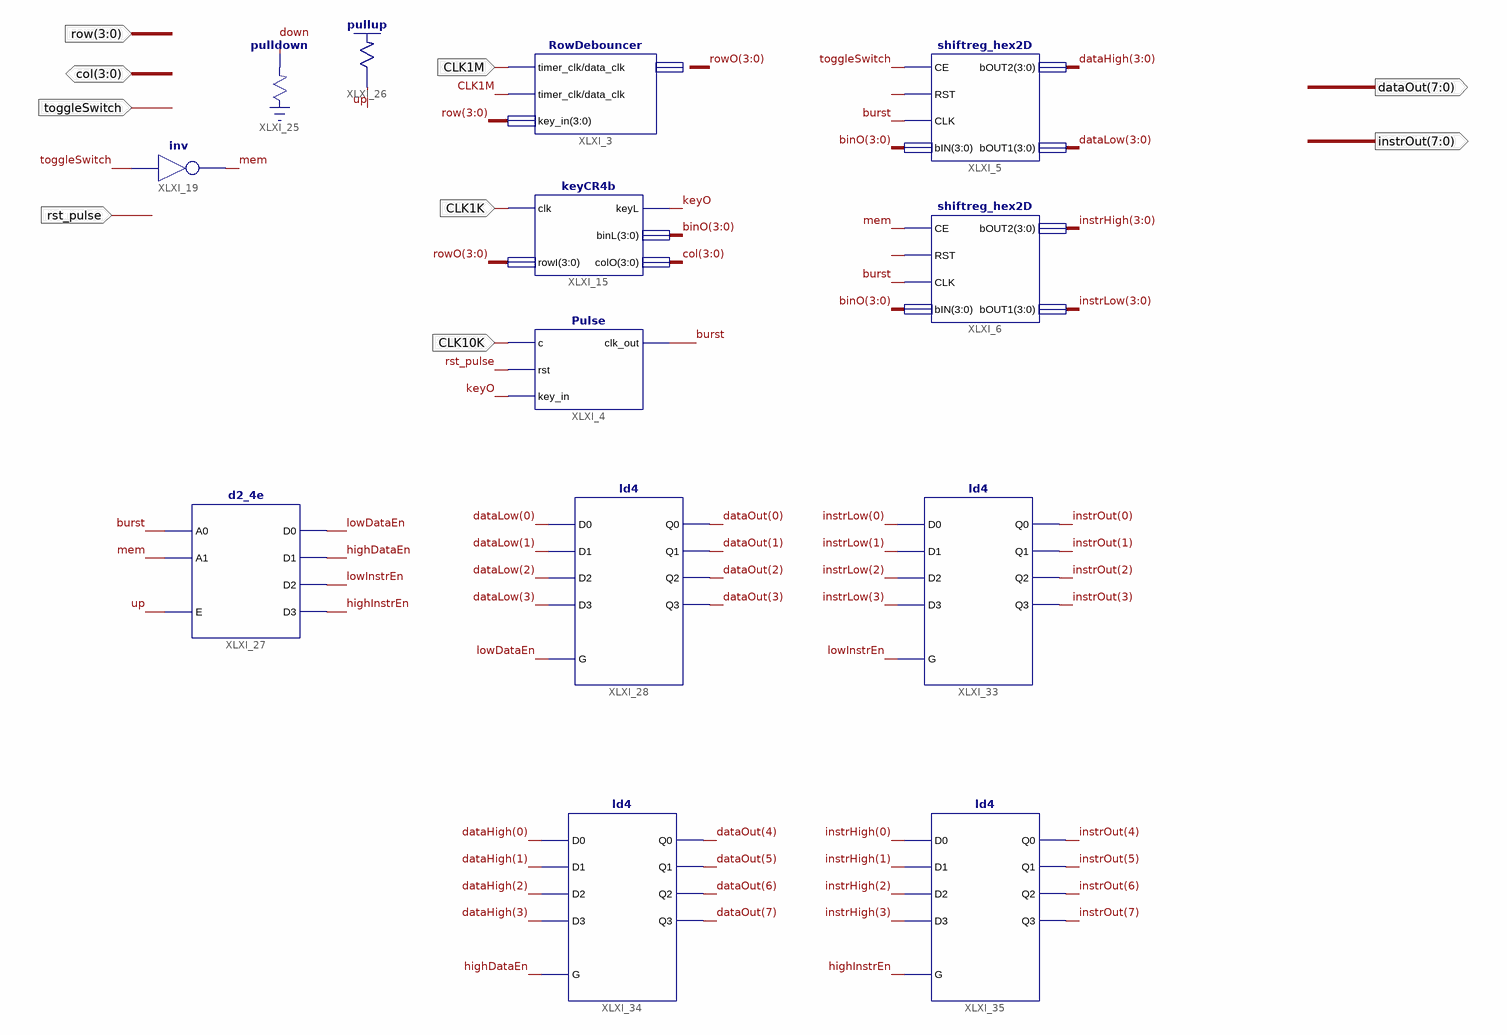
[diagram p0: schematic sheet 1]
// Xilinx ISE schematic Keypad.sch (spartan3e) as structural Verilog: 13 symbols, 9 ports
module Keypad (
  input  [3:0] row,
  input  CLK10K,
  input  toggleSwitch,
  input  rst_pulse,
  input  CLK1M,
  input  CLK1K,
  inout  [3:0] col,
  output [7:0] dataOut,
  output [7:0] instrOut
);

  wire burst, down, highDataEn, highInstrEn, keyO, lowDataEn, lowInstrEn, mem, up, XLXN_29, XLXN_33;
  wire [3:0] binO, dataHigh, dataLow, instrHigh, instrLow, rowO;

  Pulse XLXI_4 (.c(CLK10K), .rst(rst_pulse), .key_in(keyO), .clk_out(burst));
  RowDebouncer XLXI_3 (.timer_clk(CLK1M), .data_clk(CLK1M), .key_in(row), .stable_out(rowO));
  keyCR4b XLXI_15 (.clk(CLK1K), .rowI(rowO), .keyL(keyO), .binL(binO), .colO(col));
  not XLXI_19 (mem, toggleSwitch);
  shiftreg_hex2D XLXI_5 (.CE(toggleSwitch), .RST(XLXN_29), .CLK(burst), .bIN(binO), .bOUT2(dataHigh), .bOUT1(dataLow));
  shiftreg_hex2D XLXI_6 (.CE(mem), .RST(XLXN_33), .CLK(burst), .bIN(binO), .bOUT2(instrHigh), .bOUT1(instrLow));
  \pulldown  XLXI_25 (.O(down));
  \pullup  XLXI_26 (.O(up));
  d2_4e XLXI_27 (.A0(burst), .A1(mem), .E(up), .D0(lowDataEn), .D1(highDataEn), .D2(lowInstrEn), .D3(highInstrEn));
  ld4 XLXI_28 (
    .D0(dataLow[0]), .D1(dataLow[1]), .D2(dataLow[2]), .D3(dataLow[3]), .G(lowDataEn), .Q0(dataOut[0]),
    .Q1(dataOut[1]), .Q2(dataOut[2]), .Q3(dataOut[3]));
  ld4 XLXI_34 (
    .D0(dataHigh[0]), .D1(dataHigh[1]), .D2(dataHigh[2]), .D3(dataHigh[3]), .G(highDataEn), .Q0(dataOut[4]),
    .Q1(dataOut[5]), .Q2(dataOut[6]), .Q3(dataOut[7]));
  ld4 XLXI_33 (
    .D0(instrLow[0]), .D1(instrLow[1]), .D2(instrLow[2]), .D3(instrLow[3]), .G(lowInstrEn), .Q0(instrOut[0]),
    .Q1(instrOut[1]), .Q2(instrOut[2]), .Q3(instrOut[3]));
  ld4 XLXI_35 (
    .D0(instrHigh[0]), .D1(instrHigh[1]), .D2(instrHigh[2]), .D3(instrHigh[3]), .G(highInstrEn),
    .Q0(instrOut[4]), .Q1(instrOut[5]), .Q2(instrOut[6]), .Q3(instrOut[7]));
endmodule
